# EAGLE schematic Power Board Testing Interface (EAGLE 7.6.0)
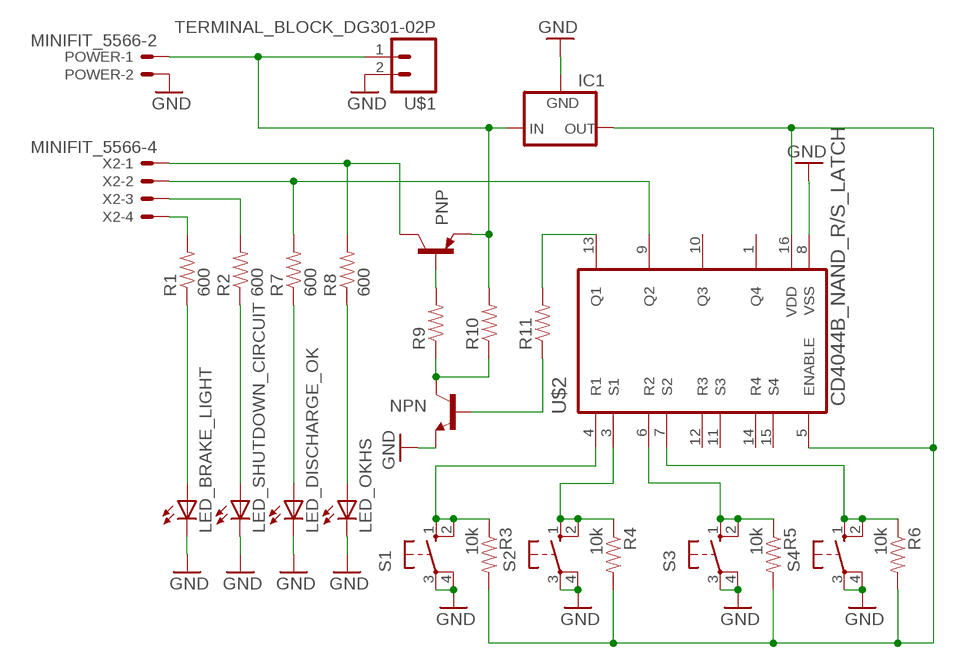
[diagram p0: schematic, sheet 1]

## Parts
IC1  5V_REGULATOR_L7805SWITCHING  [TO-220]
LED_BRAKE_LIGHT  LED-5MM  [LED-5MM]
LED_DISCHARGE_OK  LED-5MM  [LED-5MM]
LED_OKHS  LED-5MM  [LED-5MM]
LED_SHUTDOWN_CIRCUIT  LED-5MM  [LED-5MM]
NPN  BJT_NPNTIP120  [TO-220]
PNP  BJT_PNP  [TO-220]
POWER  MINIFIT_5566-2  [MINIFIT_5566-2]
R1  600  RESISTOREZ  [AXIAL-0.3EZ]
R2  600  RESISTOREZ  [AXIAL-0.3EZ]
R3  10k  RESISTOREZ  [AXIAL-0.3EZ]
R4  10k  RESISTOREZ  [AXIAL-0.3EZ]
R5  10k  RESISTOREZ  [AXIAL-0.3EZ]
R6  10k  RESISTOREZ  [AXIAL-0.3EZ]
R7  600  RESISTOREZ  [AXIAL-0.3EZ]
R8  600  RESISTOREZ  [AXIAL-0.3EZ]
R9  RESISTOREZ  [AXIAL-0.3EZ]
R10  RESISTOREZ  [AXIAL-0.3EZ]
R11  RESISTOREZ  [AXIAL-0.3EZ]
S1  BTN_10-XX  [B3F-10XX]
S2  BTN_10-XX  [B3F-10XX]
S3  BTN_10-XX  [B3F-10XX]
S4  BTN_10-XX  [B3F-10XX]
U$1  TERMINAL_BLOCK_DG301-02P  [DG301-02P]
U$2  CD4044B_NAND_R/S_LATCH  [DIL16]
X2  MINIFIT_5566-4  [MINIFIT_5566-4]

## Nets
GND: IC1.2(GND) LED_BRAKE_LIGHT.K(C) LED_DISCHARGE_OK.K(C) LED_OKHS.K(C) LED_SHUTDOWN_CIRCUIT.K(C) NPN.3(EMITTER) POWER.2 S1.3(P) S1.4(P1) S2.3(P) S2.4(P1) S3.3(P) S3.4(P1) S4.3(P) S4.4(P1) U$1.2 U$2.8(VSS)
N$1: IC1.1(IN) PNP.3(E) POWER.1 R10.P$2 U$1.1
N$2: R1.P$2 X2.4
N$3: LED_BRAKE_LIGHT.A R1.P$1
N$4: R2.P$2 X2.3
N$5: LED_SHUTDOWN_CIRCUIT.A R2.P$1
N$6: IC1.3(OUT) R3.P$2 R4.P$2 R5.P$2 R6.P$2 U$2.5(ENABLE) U$2.16(VDD)
N$7: PNP.1(B) R9.P$2
N$8: R11.P$2 U$2.13(Q1)
N$9: R7.P$2 U$2.9(Q2) X2.2
N$10: R3.P$1 S1.1(S) S1.2(S1) U$2.4(R1)
N$11: R4.P$1 S2.1(S) S2.2(S1) U$2.3(S1)
N$12: LED_DISCHARGE_OK.A R7.P$1
N$13: LED_OKHS.A R8.P$1
N$14: R5.P$1 S3.1(S) S3.2(S1) U$2.6(R2)
N$15: R6.P$1 S4.1(S) S4.2(S1) U$2.7(S2)
N$16: PNP.2(C) R8.P$2 X2.1
N$17: NPN.2(COLLECTOR) R9.P$1 R10.P$1
N$18: NPN.1(BASE) R11.P$1
Unconnected: U$2.1(Q4) U$2.10(Q3) U$2.11(S3) U$2.14(R4) U$2.15(S4)

## Power pins joined to a net without a drawn wire
R3: U$2.12(R3)

## Library data of the parts
IC1 = HyTechDevices:5V_REGULATOR_L7805: Voltage Regulator Switching 5v regulator Datasheet <http://power.murata.com/data/power/oki-78sr.pdf> Standard 7805 5V regulator. IGO (Input Ground Output). Spark Fun Electronics SKU : COM-00107 Datasheet <http://www.mouser.com/ds/2/308/MC7800-D-94905.pdf>
LED_BRAKE_LIGHT LED_DISCHARGE_OK LED_OKHS LED_SHUTDOWN_CIRCUIT = HyTechDevices:LED: Light Emitting Diode Source: Dangerous Prototypes Eagle Library <https://github.com/DangerousPrototypes/Eagle_Part_Library>
NPN = HyTechDevices:BJT_NPN: Generic NPN BJT MMBT2222A - TRANS-08049 (SOT-23, 1A 40V) MPSA42 - TRANS-09116 (SOT-23, 500mA 300V) MMBT5088LT1G - TRANS-11160 (SOT-23, 50 mA 30V) BC547 - COM-08928 <http://www.sparkfun.com/products/8928> (TO-92 45V 100mA) (1.Collector 2.Base 3.Emitter) 2N3904 - COM-00521 <http://www.sparkfun.com/products/521> (TO-92 40V 200mA) (1.Emitter 2.Base 3.Collector) P2N2222A - COM-12852 <http://www.sparkfun.com/products/12852> (TO-92 40V 600mA) (1.Collector 2.Base 3.Emitter) Source: Sparkfun <https://github.com/sparkfun/SparkFun-Eagle-Libraries>
PNP = HyTechDevices:BJT_PNP: Generic PNP BJT
POWER = HyTechDevices:MINIFIT_5566-2: Mini FIT Junior connector 2 pole Source: http://www.molex.com; OC_FARNELL: 1822072; OC_NEWARK: unknown
R1-R11 = HyTechDevices:RESISTOR: Resistor Basic schematic elements and footprints for 0603, 1206, and PTH resistors.
S1-S4 = HyTechDevices:BTN_10-XX: OMRON SWITCH; MPN: B3F-1000; OC_FARNELL: 176432; OC_NEWARK: 36M3542
U$1 = HyTechDevices:TERMINAL_BLOCK_DG301-02P: DG301-02P Terminal block Tayda Electronics Store <http://www.taydaelectronics.com/connectors-sockets/terminal-blocks/dg301-screw-terminal-block-2-positions-5mm.html> Datasheet <http://www.tme.eu/en/Document/72ad9f371bb0c16572574ac47903b3a1/DG301-5.0.pdf> Specs: Positions: 2 Pitch: 5.00mm Wire: 12-24 AWG Max Current: 15A Max Voltage: 300V
U$2 = HyTechDevices:CD4044B_NAND_R/S_LATCH: Texas Instruments CD4044B CMOS Quad 3-State NAND R/S Latch
X2 = HyTechDevices:MINIFIT_5566-4: Mini FIT Junior connector 4 pole Source: http://www.molex.com; OC_FARNELL: unknown; OC_NEWARK: unknown